# EAGLE design BreakoutDiagram (EAGLE 9.5.2)
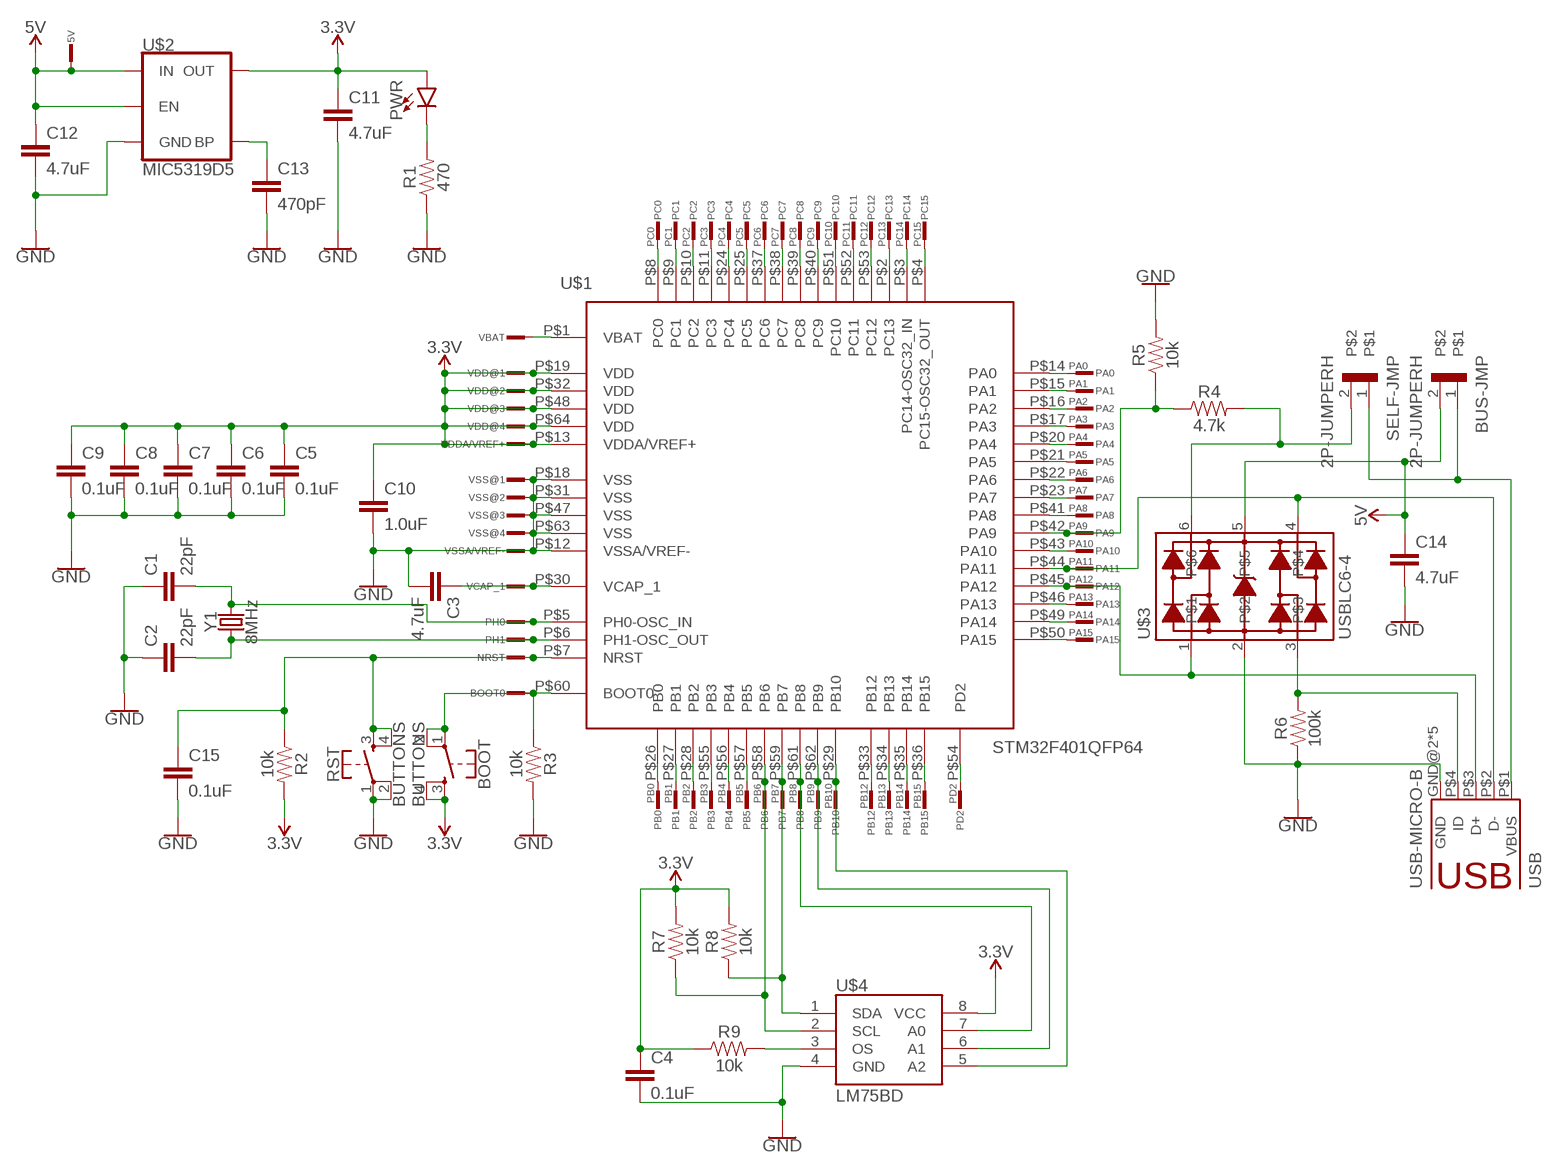
[diagram p0: schematic, sheet 1]

## Parts
5V  PINV  [1X01]
BOOT  BUTTONS  [TACTILE_SWITCH_PTH_6.0MM]
BOOT0  PINH  [1X01_HLABEL]
BUS-JMP  2P-JUMPERH  [1X02]
C1  22pF  22PF-0603-50V-5%  [0603]
C2  22pF  22PF-0603-50V-5%  [0603]
C3  4.7uF  4.7UF-0603-6.3V-(10%)  [0603]
C4  0.1uF  0.1UF-0603-25V-(+80/-20%)  [0603]
C5  0.1uF  0.1UF-0402-16V-10%  [0402]
C6  0.1uF  0.1UF-0402-16V-10%  [0402]
C7  0.1uF  0.1UF-0402-16V-10%  [0402]
C8  0.1uF  0.1UF-0402-16V-10%  [0402]
C9  0.1uF  0.1UF-0402-16V-10%  [0402]
C10  1.0uF  1.0UF-0603-16V-10%  [0603]
C11  4.7uF  4.7UF-0603-6.3V-(10%)  [0603]
C12  4.7uF  4.7UF-0603-6.3V-(10%)  [0603]
C13  470pF  470PF-0603-50V-5%  [0603]
C14  4.7uF  4.7UF-0603-6.3V-(10%)  [0603]
C15  0.1uF  0.1UF-0603-25V-(+80/-20%)  [0603]
NRST  PINH  [1X01_HLABEL]
PA0  PINH  [1X01_HLABEL]
PA1  PINH  [1X01_HLABEL]
PA2  PINH  [1X01_HLABEL]
PA3  PINH  [1X01_HLABEL]
PA4  PINH  [1X01_HLABEL]
PA5  PINH  [1X01_HLABEL]
PA6  PINH  [1X01_HLABEL]
PA7  PINH  [1X01_HLABEL]
PA8  PINH  [1X01_HLABEL]
PA9  PINH  [1X01_HLABEL]
PA10  PINH  [1X01_HLABEL]
PA11  PINH  [1X01_HLABEL]
PA12  PINH  [1X01_HLABEL]
PA13  PINH  [1X01_HLABEL]
PA14  PINH  [1X01_HLABEL]
PA15  PINH  [1X01_HLABEL]
PB0  PINH  [1X01_HLABEL]
PB1  PINH  [1X01_HLABEL]
PB2  PINH  [1X01_HLABEL]
PB3  PINH  [1X01_HLABEL]
PB4  PINH  [1X01_HLABEL]
PB5  PINH  [1X01_HLABEL]
PB6  PINH  [1X01_HLABEL]
PB7  PINH  [1X01_HLABEL]
PB8  PINH  [1X01_HLABEL]
PB9  PINH  [1X01_HLABEL]
PB10  PINH  [1X01_HLABEL]
PB12  PINH  [1X01_HLABEL]
PB13  PINH  [1X01_HLABEL]
PB14  PINH  [1X01_HLABEL]
PB15  PINH  [1X01_HLABEL]
PC0  PINH  [1X01_HLABEL]
PC1  PINH  [1X01_HLABEL]
PC2  PINH  [1X01_HLABEL]
PC3  PINH  [1X01_HLABEL]
PC4  PINH  [1X01_HLABEL]
PC5  PINH  [1X01_HLABEL]
PC6  PINH  [1X01_HLABEL]
PC7  PINH  [1X01_HLABEL]
PC8  PINH  [1X01_HLABEL]
PC9  PINH  [1X01_HLABEL]
PC10  PINH  [1X01_HLABEL]
PC11  PINH  [1X01_HLABEL]
PC12  PINH  [1X01_HLABEL]
PC13  PINH  [1X01_HLABEL]
PC14  PINH  [1X01_HLABEL]
PC15  PINH  [1X01_HLABEL]
PD2  PINH  [1X01_HLABEL]
PH0  PINH  [1X01_HLABEL]
PH1  PINH  [1X01_HLABEL]
PWR  LED0603  [LED-0603]
R1  470  470OHM-0402-1/16W-5%  [0402]
R2  10k  10KOHM-0402-1/16W-1%  [0402]
R3  10k  10KOHM-0402-1/16W-1%  [0402]
R4  4.7k  4.7KOHM-0603-1/10W-1%  [0603]
R5  10k  10KOHM-0603-1/10W-1%  [0603]
R6  100k  100KOHM-0603-1/10W-1%  [0603]
R7  10k  10KOHM-0402-1/16W-1%  [0402]
R8  10k  10KOHM-0402-1/16W-1%  [0402]
R9  10k  10KOHM-0402-1/16W-1%  [0402]
RST  BUTTONS  [TACTILE_SWITCH_PTH_6.0MM]
SELF-JMP  2P-JUMPERH  [1X02]
U$1  STM32F401QFP64  [LQFP64]
U$2  MIC5319D5  [SOT23-5]
U$3  USBLC6-4  [SOT23-6L]
U$4  LM75BD  [SO8]
USB  USB-MICRO-B  [USB-MICRO-B_SMD_CUT]
VBAT  PINH  [1X01_HLABEL]
VCAP_1  PINH  [1X01_HLABEL]
VDD@1  PINH  [1X01_HLABEL]
VDD@2  PINH  [1X01_HLABEL]
VDD@3  PINH  [1X01_HLABEL]
VDD@4  PINH  [1X01_HLABEL]
VDDA/VREF+  PINH  [1X01_HLABEL]
VSS@1  PINH  [1X01_HLABEL]
VSS@2  PINH  [1X01_HLABEL]
VSS@3  PINH  [1X01_HLABEL]
VSS@4  PINH  [1X01_HLABEL]
VSSA/VREF-  PINH  [1X01_HLABEL]
Y1  8MHz  CRYSTALSMD-5X3.2-2PAD  [CRYSTAL-SMD-5X3.2-2PAD]

## Nets
3.3V: BOOT.3 BOOT.4 C4.1 C5.1 C6.1 C7.1 C8.1 C9.1 C10.1 C11.1 PWR.A R2.2 R7.2 R8.2 R9.1 U$1.P$13(VDDA/VREF+) U$1.P$19(VDD) U$1.P$32(VDD) U$1.P$48(VDD) U$1.P$64(VDD) U$2.5(OUT) U$4.8(VCC) VDD@1.1 VDD@2.1 VDD@3.1 VDD@4.1 VDDA/VREF+.1
5V: 5V.1 BUS-JMP.2 C12.1 C14.1 U$2.1(IN) U$2.3(EN) U$3.5
GND: C1.1 C2.1 C3.2 C4.2 C5.2 C6.2 C7.2 C8.2 C9.2 C10.2 C11.2 C12.2 C13.2 C14.2 C15.2 R1.1 R3.2 R5.2 R6.1 RST.1 RST.2 U$1.P$12(VSSA/VREF-) U$1.P$18(VSS) U$1.P$31(VSS) U$1.P$47(VSS) U$1.P$63(VSS) U$2.2(GND) U$3.2 U$4.4(GND) USB.GND@2(GND) USB.GND@3(GND) USB.GND@4(GND) USB.GND@5(GND) USB.P$5(GND) VSS@1.1 VSS@2.1 VSS@3.1 VSS@4.1 VSSA/VREF-.1
N$1: C2.2 PH1.1 U$1.P$6(PH1-OSC_OUT) Y1.P$1
N$2: C1.2 PH0.1 U$1.P$5(PH0-OSC_IN) Y1.P$2
N$3: C3.1 U$1.P$30(VCAP_1) VCAP_1.1
N$4: PWR.C R1.2
N$5: C13.1 U$2.4(BP)
N$6: C15.1 NRST.1 R2.1 RST.3 RST.4 U$1.P$7(NRST)
N$7: BOOT0.1 BOOT.1 BOOT.2 R3.1 U$1.P$60(BOOT0)
N$8: R9.2 U$4.3(OS)
N$9: BUS-JMP.1 SELF-JMP.1 USB.P$1(VBUS)
N$11: R4.2 SELF-JMP.2 U$3.6
N$13: R6.2 U$3.3 USB.P$4(ID)
N$14: U$1.P$1(VBAT) VBAT.1
PA0: PA0.1 U$1.P$14(PA0)
PA1: PA1.1 U$1.P$15(PA1)
PA2: PA2.1 U$1.P$16(PA2)
PA3: PA3.1 U$1.P$17(PA3)
PA4: PA4.1 U$1.P$20(PA4)
PA5: PA5.1 U$1.P$21(PA5)
PA6: PA6.1 U$1.P$22(PA6)
PA7: PA7.1 U$1.P$23(PA7)
PA8: PA8.1 U$1.P$41(PA8)
PA9: PA9.1 R4.1 R5.1 U$1.P$42(PA9)
PA10: PA10.1 U$1.P$43(PA10)
PA11: PA11.1 U$1.P$44(PA11) U$3.4 USB.P$2(D-)
PA12: PA12.1 U$1.P$45(PA12) U$3.1 USB.P$3(D+)
PA13: PA13.1 U$1.P$46(PA13)
PA14: PA14.1 U$1.P$49(PA14)
PA15: PA15.1 U$1.P$50(PA15)
PB0: PB0.1 U$1.P$26(PB0)
PB1: PB1.1 U$1.P$27(PB1)
PB2: PB2.1 U$1.P$28(PB2)
PB3: PB3.1 U$1.P$55(PB3)
PB4: PB4.1 U$1.P$56(PB4)
PB5: PB5.1 U$1.P$57(PB5)
PB6: PB6.1 R7.1 U$1.P$58(PB6) U$4.2(SCL)
PB7: PB7.1 R8.1 U$1.P$59(PB7) U$4.1(SDA)
PB8: PB8.1 U$1.P$61(PB8) U$4.7(A0)
PB9: PB9.1 U$1.P$62(PB9) U$4.6(A1)
PB10: PB10.1 U$1.P$29(PB10) U$4.5(A2)
PB12: PB12.1 U$1.P$33(PB12)
PB13: PB13.1 U$1.P$34(PB13)
PB14: PB14.1 U$1.P$35(PB14)
PB15: PB15.1 U$1.P$36(PB15)
PC0: PC0.1 U$1.P$8(PC0)
PC1: PC1.1 U$1.P$9(PC1)
PC2: PC2.1 U$1.P$10(PC2)
PC3: PC3.1 U$1.P$11(PC3)
PC4: PC4.1 U$1.P$24(PC4)
PC5: PC5.1 U$1.P$25(PC5)
PC6: PC6.1 U$1.P$37(PC6)
PC7: PC7.1 U$1.P$38(PC7)
PC8: PC8.1 U$1.P$39(PC8)
PC9: PC9.1 U$1.P$40(PC9)
PC10: PC10.1 U$1.P$51(PC10)
PC11: PC11.1 U$1.P$52(PC11)
PC12: PC12.1 U$1.P$53(PC12)
PC13: PC13.1 U$1.P$2(PC13)
PC14: PC14.1 U$1.P$3(PC14-OSC32_IN)
PC15: PC15.1 U$1.P$4(PC15-OSC32_OUT)
PD2: PD2.1 U$1.P$54(PD2)

## Library data of the parts
5V BOOT0 NRST PA0 PA1-PA15 PB0 PB1-PB10 PB12-PB15 PC0 PC1-PC15 PD2 PH0 PH1 VBAT VCAP_1 VDD@1-VDD@4 VDDA/VREF+ VSS@1-VSS@4 VSSA/VREF- = myLib:PIN
BOOT RST = myLib:BUTTON
BUS-JMP SELF-JMP = myLib:2P-JUMPER
C1 C2 = SparkFun-Capacitors:22PF: 22pF ceramic capacitors A capacitor is a passive two-terminal electrical component used to store electrical energy temporarily in an electric field.; PROD_ID: CAP-07876
C3 C11 C12 C14 = SparkFun-Capacitors:4.7UF: 4.7µF ceramic capacitors A capacitor is a passive two-terminal electrical component used to store electrical energy temporarily in an electric field.; PROD_ID: CAP-08280
C4 C15 = SparkFun-Capacitors:0.1UF: 0.1µF ceramic capacitors A capacitor is a passive two-terminal electrical component used to store electrical energy temporarily in an electric field.; PROD_ID: CAP-00810
C5-C9 = SparkFun-Capacitors:0.1UF: 0.1µF ceramic capacitors A capacitor is a passive two-terminal electrical component used to store electrical energy temporarily in an electric field.; PROD_ID: CAP-12416
C10 = SparkFun-Capacitors:1.0UF: 1µF ceramic capacitors A capacitor is a passive two-terminal electrical component used to store electrical energy temporarily in an electric field.; PROD_ID: CAP-00868
C13 = SparkFun-Capacitors:470PF: 470pF ceramic capacitors A capacitor is a passive two-terminal electrical component used to store electrical energy temporarily in an electric field.; PROD_ID: CAP-07884
PWR = SparkFun-LED:LED: LED (Generic) Standard schematic elements and footprints for 5mm, 3mm, 1206, and 0603 sized LEDs. Generic LEDs with no color specified.
R1 = SparkFun-Resistors:470OHM: 470Ω resistor A resistor is a passive two-terminal electrical component that implements electrical resistance as a circuit element. Resistors act to reduce current flow, and, at the same time, act to lower voltage levels within circuits. - Wikipedia; PROD_ID: RES-13829
R2 R3 R7-R9 = SparkFun-Resistors:10KOHM: 10kΩ resistor A resistor is a passive two-terminal electrical component that implements electrical resistance as a circuit element. Resistors act to reduce current flow, and, at the same time, act to lower voltage levels within circuits. - Wikipedia; PROD_ID: RES-14241
R4 = SparkFun-Resistors:4.7KOHM: 4.7kΩ resistor A resistor is a passive two-terminal electrical component that implements electrical resistance as a circuit element. Resistors act to reduce current flow, and, at the same time, act to lower voltage levels within circuits. - Wikipedia; PROD_ID: RES-07857
R5 = SparkFun-Resistors:10KOHM: 10kΩ resistor A resistor is a passive two-terminal electrical component that implements electrical resistance as a circuit element. Resistors act to reduce current flow, and, at the same time, act to lower voltage levels within circuits. - Wikipedia; PROD_ID: RES-00824
R6 = SparkFun-Resistors:100KOHM: 100kΩ resistor A resistor is a passive two-terminal electrical component that implements electrical resistance as a circuit element. Resistors act to reduce current flow, and, at the same time, act to lower voltage levels within circuits. - Wikipedia; PROD_ID: RES-07828
U$1 = myLib:STM32F401
U$2 = myLib:MIC5319
U$3 = myLib:USBLC6-4: USBLC6-4 USB Circuit Protection Used for STM32 USB self-powered configuration Product Link: https://www.digikey.com/product-detail/en/stmicroelectronics/USBLC6-4SC6/497-4492-1-ND/725667
U$4 = myLib:LM75B: LM75B Digital Temperature Sensor and Thermal Watchdog Datasheet <https://www.nxp.com/docs/en/data-sheet/LM75B.pdf> Digikey Links: SO8 Package <https://www.digikey.com/product-detail/en/nxp-usa-inc/LM75BD-118/568-4688-1-ND/1993025>
USB = myLib:USB-MICRO-B
Y1 = SparkFun-Clocks:CRYSTAL: Crystals (Generic) These are passive quartz crystals, which can be used as a clock source for a microcontroller. Crystal's are two-terminal devices. They require external "load" capacitors to generate an oscillating signal.

## Board
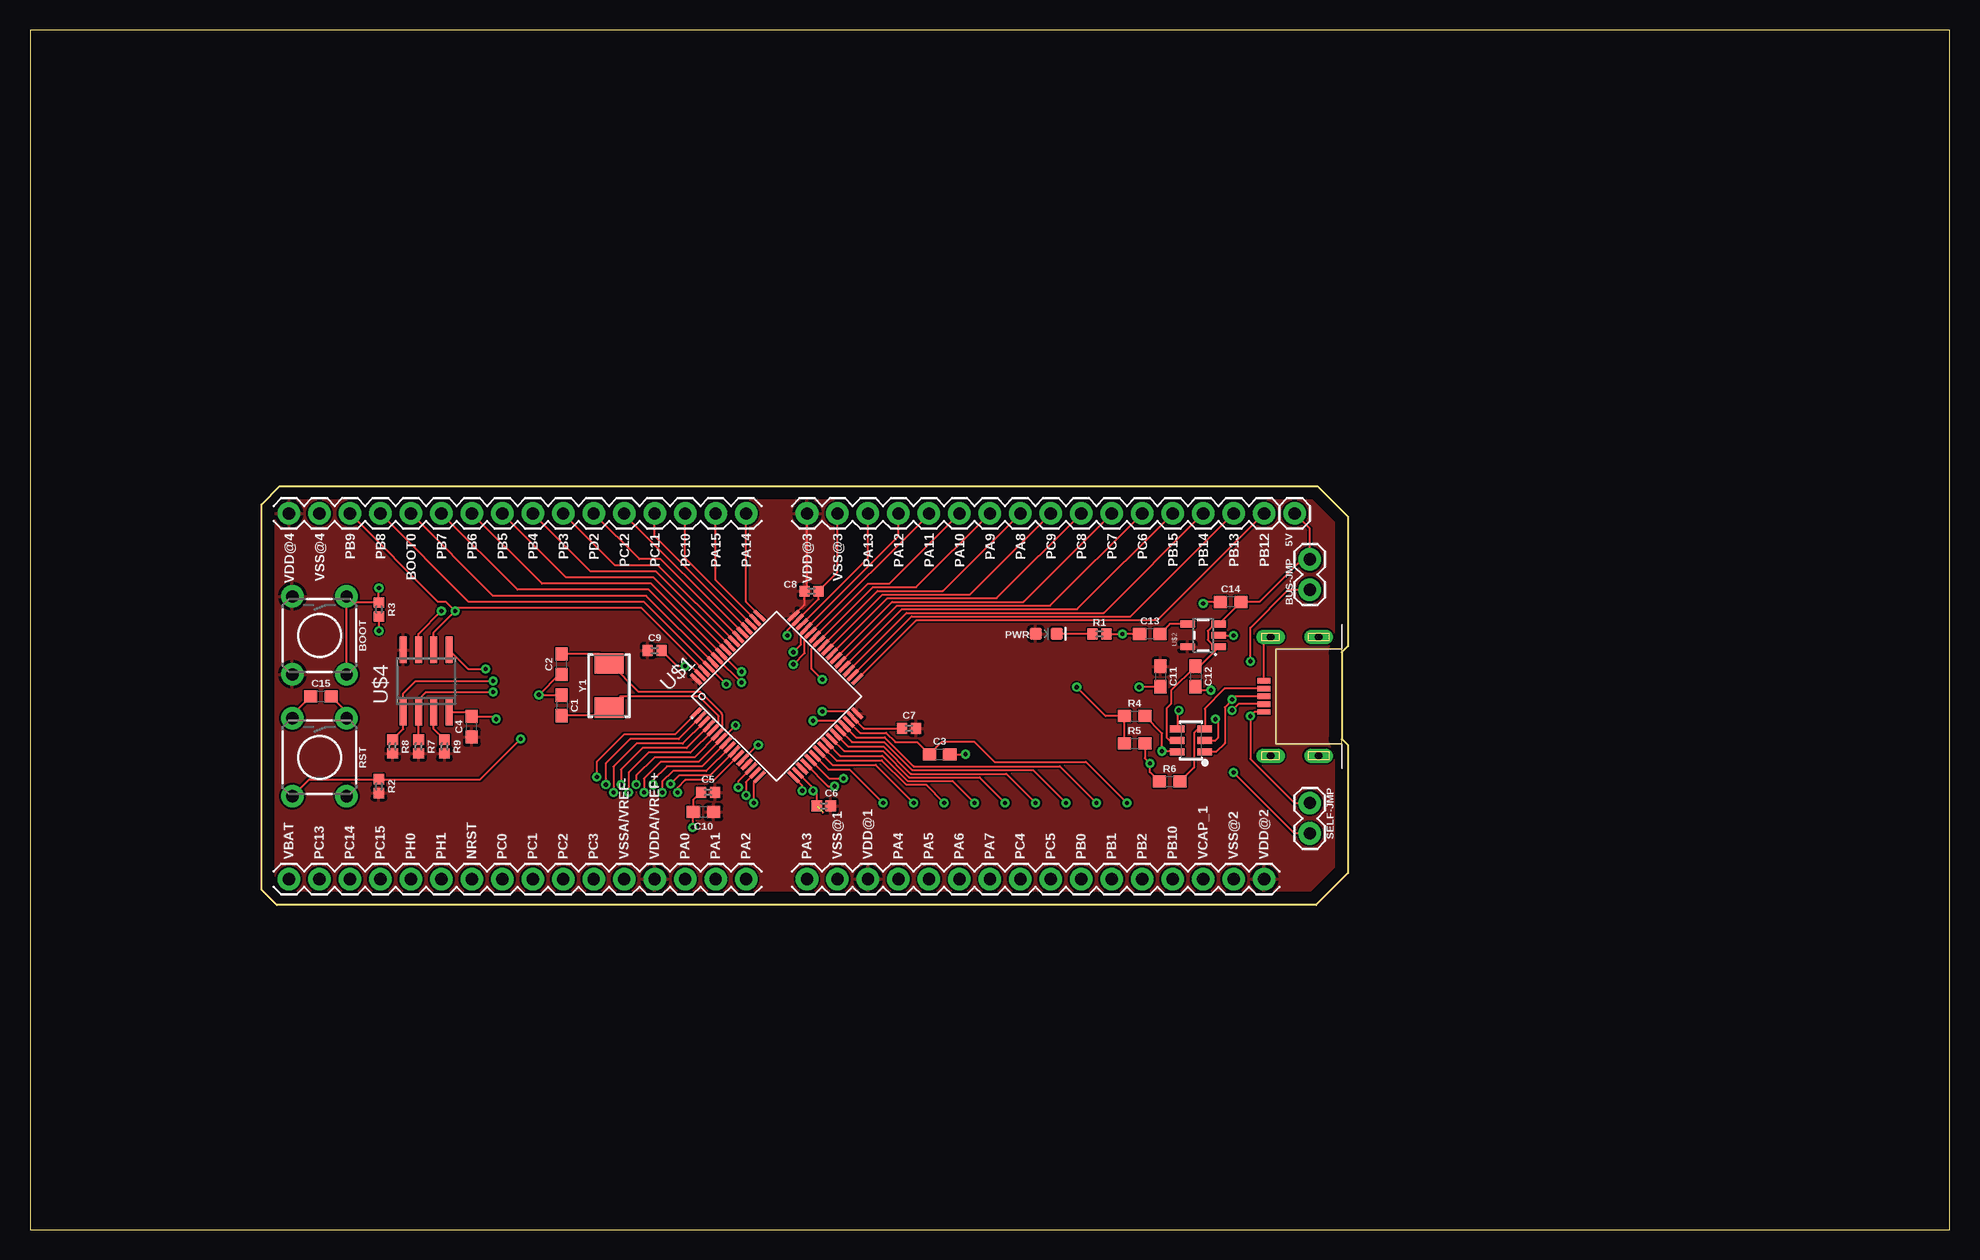
[diagram p1: board, top side]
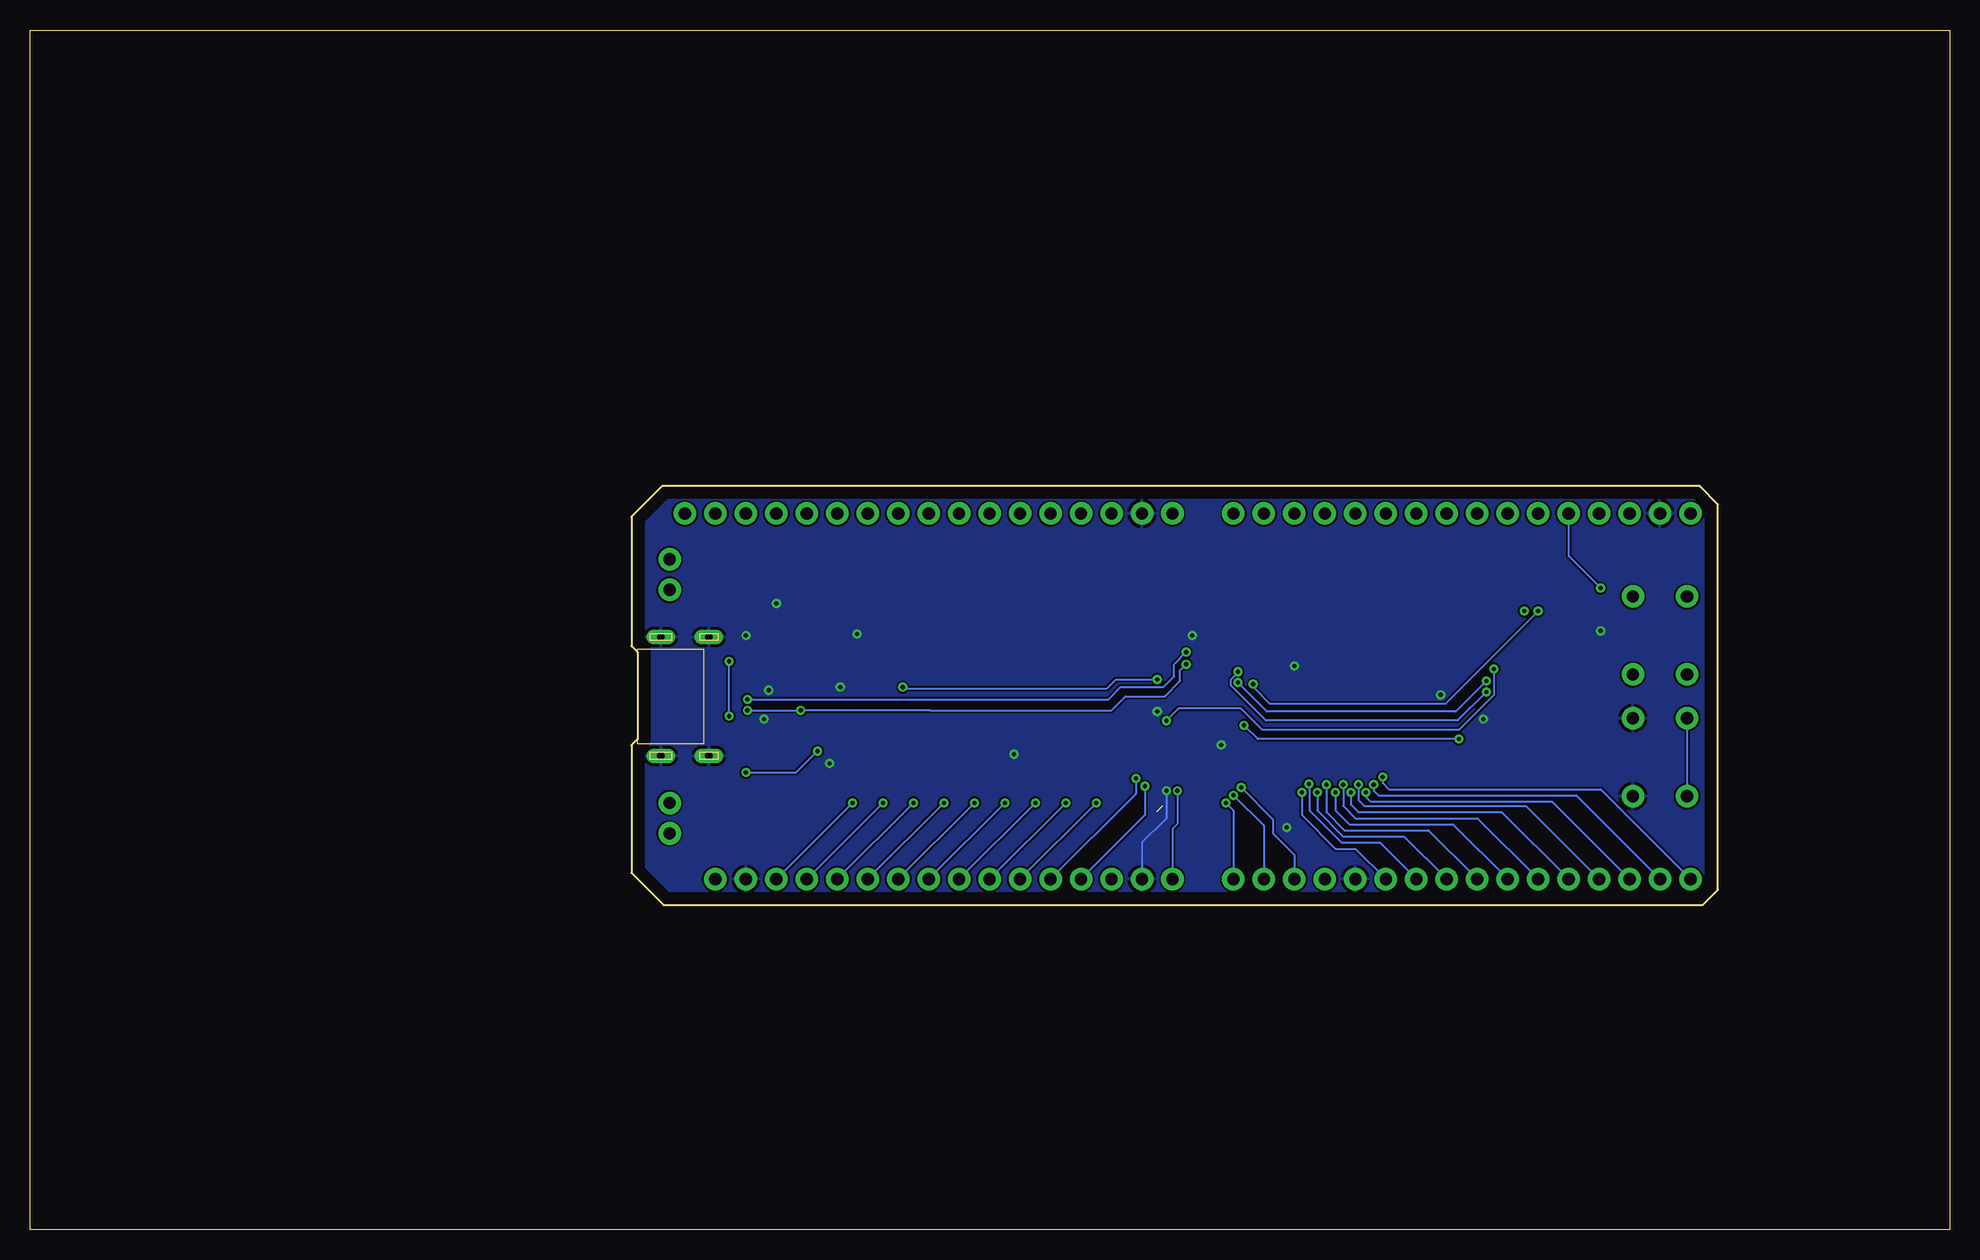
[diagram p2: board, bottom side, seen from below]

Size 160 x 100 mm. Coordinates in mm from the lower left corner, seen from the top.
Outline: 0,0 160,0 160,100 0,100 0,0
Outline: 109.86,29.72 107.19,27.05 20.57,27.05 19.3,28.32 19.3,60.45 20.83,61.98 107.31,61.98 109.86,59.44 109.86,48.64 109.35,48.13 109.35,40.89 109.86,40.39 109.86,29.72
Copper layers (1*16): Top 0.035mm / dielectric 1.5mm / Bottom 0.035mm
Design rules "default": minimum track width 6mil, minimum drill 0.35mm, track to track 6mil, track to pad 6mil, pad to pad 6mil, via to via 6mil, smd to smd 6mil, copper to edge 40mil, drill to drill 6mil, minimum pad ring 10mil, minimum via ring 8mil, stop-mask expansion 4mil, vias tented up to drill 0mil, thermal gap 10mil

### Footprints (pad centres in the part's own frame; a part is rotated, then mirrored left to right if it is on the bottom)
1X01 = drill 1.016 pad 1.88: 1 0,0
TACTILE_SWITCH_PTH_6.0MM = drill 1.016 pad 1.88: 1 -3.251,2.261; 2 3.251,2.261; 3 -3.251,-2.261; 4 3.251,-2.261
1X01_HLABEL = drill 1.016 pad 1.88: 1 0,0
1X02 = drill 1.016 pad 1.88: 1 0,0; 2 2.54,0
0603 = smd 1.1 x 1: 1 -0.85,0; 2 0.85,0
0402 = smd 0.85 x 0.9: 1 -0.58,0; 2 0.58,0
LED-0603 = smd 1 x 1: A -0.877,0; C 0.877,0
LQFP64 = smd 1.2 x 0.3: P$1 -5.75,3.75; P$2 -5.75,3.25; P$3 -5.75,2.75; P$4 -5.75,2.25; P$5 -5.75,1.75; P$6 -5.75,1.25; P$7 -5.75,0.75; P$8 -5.75,0.25; P$9 -5.75,-0.25; P$10 -5.75,-0.75; P$11 -5.75,-1.25; P$12 -5.75,-1.75; P$13 -5.75,-2.25; P$14 -5.75,-2.75; P$15 -5.75,-3.25; P$16 -5.75,-3.75; P$33 5.75,-3.75; P$34 5.75,-3.25; P$35 5.75,-2.75; P$36 5.75,-2.25; P$37 5.75,-1.75; P$38 5.75,-1.25; P$39 5.75,-0.75; P$40 5.75,-0.25; P$41 5.75,0.25; P$42 5.75,0.75; P$43 5.75,1.25; P$44 5.75,1.75; P$45 5.75,2.25; P$46 5.75,2.75; P$47 5.75,3.25; P$48 5.75,3.75 | smd 0.3 x 1.2: P$17 -3.75,-5.75; P$18 -3.25,-5.75; P$19 -2.75,-5.75; P$20 -2.25,-5.75; P$21 -1.75,-5.75; P$22 -1.25,-5.75; P$23 -0.75,-5.75; P$24 -0.25,-5.75; P$25 0.25,-5.75; P$26 0.75,-5.75; P$27 1.25,-5.75; P$28 1.75,-5.75; P$29 2.25,-5.75; P$30 2.75,-5.75; P$31 3.25,-5.75; P$32 3.75,-5.75; P$49 3.75,5.75; P$50 3.25,5.75; P$51 2.75,5.75; P$52 2.25,5.75; P$53 1.75,5.75; P$54 1.25,5.75; P$55 0.75,5.75; P$56 0.25,5.75; P$57 -0.25,5.75; P$58 -0.75,5.75; P$59 -1.25,5.75; P$60 -1.75,5.75; P$61 -2.25,5.75; P$62 -2.75,5.75; P$63 -3.25,5.75; P$64 -3.75,5.75
SOT23-5 = smd 0.55 x 1.2: 1 -0.95,-1.3; 2 0,-1.3; 3 0.95,-1.3; 4 0.95,1.3; 5 -0.95,1.3
SOT23-6L = smd 0.6 x 1.2: 1 -0.95,-1.15; 2 0,-1.15; 3 0.95,-1.15; 4 0.95,1.15; 5 0,1.15; 6 -0.95,1.15
SO8 = smd 0.6 x 2.2: 1 -1.905,-2.6; 2 -0.635,-2.6; 3 0.635,-2.6; 4 1.905,-2.6; 5 1.905,2.6; 6 0.635,2.6; 7 -0.635,2.6; 8 -1.905,2.6
USB-MICRO-B_SMD_CUT = drill 0.6 pad 1.2 long: GND@2 -4.95,2; GND@3 4.95,2; GND@4 4.95,-2; GND@5 -4.95,-2 | smd 0.45 x 1.1: P$1 -1.3,2.55; P$2 -0.65,2.55; P$3 0,2.55; P$4 0.65,2.55; P$5 1.3,2.55
CRYSTAL-SMD-5X3.2-2PAD = smd 1.7 x 2.4: P$1 1.85,0; P$2 -1.85,0

### Placement (x,y rotation side)
5V  105.41,59.69 0 top
BOOT  24.13,49.53 270 top
BOOT0  31.75,59.69 0 top
BUS-JMP  106.68,53.34 90 top
C1  44.32,43.69 270 top
C2  44.32,47.12 90 top
C3  75.82,39.62 0 top
C4  36.83,41.91 90 top
C5  56.52,36.45 180 top
C6  66.17,35.31 180 top
C7  73.28,41.78 180 top
C8  65.15,53.21 0 top
C9  52.07,48.26 0 top
C10  56.13,34.8 180 top
C11  94.23,46.1 270 top
C12  97.16,46.1 270 top
C13  93.34,49.66 180 top
C14  100.08,52.32 180 top
C15  24.26,44.45 0 top
NRST  36.83,29.21 180 top
PA0  54.61,29.21 180 top
PA1  57.15,29.21 180 top
PA2  59.69,29.21 180 top
PA3  64.77,29.21 180 top
PA4  72.39,29.21 180 top
PA5  74.93,29.21 180 top
PA6  77.47,29.21 180 top
PA7  80.01,29.21 180 top
PA8  82.55,59.69 0 top
PA9  80.01,59.69 0 top
PA10  77.47,59.69 0 top
PA11  74.93,59.69 0 top
PA12  72.39,59.69 0 top
PA13  69.85,59.69 0 top
PA14  59.69,59.69 0 top
PA15  57.15,59.69 0 top
PB0  87.63,29.21 180 top
PB1  90.17,29.21 180 top
PB2  92.71,29.21 180 top
PB3  44.45,59.69 0 top
PB4  41.91,59.69 0 top
PB5  39.37,59.69 0 top
PB6  36.83,59.69 0 top
PB7  34.29,59.69 0 top
PB8  29.21,59.69 0 top
PB9  26.67,59.69 0 top
PB10  95.25,29.21 180 top
PB12  102.87,59.69 0 top
PB13  100.33,59.69 0 top
PB14  97.79,59.69 0 top
PB15  95.25,59.69 0 top
PC0  39.37,29.21 180 top
PC1  41.91,29.21 180 top
PC2  44.45,29.21 180 top
PC3  46.99,29.21 180 top
PC4  82.55,29.21 180 top
PC5  85.09,29.21 180 top
PC6  92.71,59.69 0 top
PC7  90.17,59.69 0 top
PC8  87.63,59.69 0 top
PC9  85.09,59.69 0 top
PC10  54.61,59.69 0 top
PC11  52.07,59.69 0 top
PC12  49.53,59.69 0 top
PC13  24.13,29.21 180 top
PC14  26.67,29.21 180 top
PC15  29.21,29.21 180 top
PD2  46.99,59.69 0 top
PH0  31.75,29.21 180 top
PH1  34.29,29.21 180 top
PWR  84.71,49.66 0 top
R1  89.15,49.66 180 top
R2  29.08,36.96 270 top
R3  29.08,51.69 270 top
R4  92.08,42.8 0 top
R5  92.08,40.51 0 top
R6  95,37.34 0 top
R7  32.38,40.26 270 top
R8  30.23,40.26 270 top
R9  34.54,40.26 90 top
RST  24.13,39.37 270 top
SELF-JMP  106.68,35.56 270 top
U$1  62.23,44.45 45 top
U$2  97.79,49.53 90 top
U$3  96.77,40.77 90 top
U$4  33.02,45.72 0 top
USB  105.41,44.45 90 top
VBAT  21.59,29.21 180 top
VCAP_1  97.79,29.21 180 top
VDD@1  69.85,29.21 180 top
VDD@2  102.87,29.21 180 top
VDD@3  64.77,59.69 0 top
VDD@4  21.59,59.69 0 top
VDDA/VREF+  52.07,29.21 180 top
VSS@1  67.31,29.21 180 top
VSS@2  100.33,29.21 180 top
VSS@3  67.31,59.69 0 top
VSS@4  24.13,59.69 0 top
VSSA/VREF-  49.53,29.21 180 top
Y1  48.26,45.34 90 top

### Tracks (layer width: path | path; a pad name or v marks a point on that pad's centre or on a via)
3.3V
  Top 0.152: U$1.P$48 64.57,52.09 C8.1 64.77,53.41 VDD@3.1
  pour Top: 20.32,63.5 17.78,60.96 17.78,27.94 20.32,25.4 107.95,25.4 110.49,27.94 110.49,60.96 107.95,63.5
5V
  Top 0.152: U$3.5 95,40.77 94.74,41.02 94.74,43.43 95.12,43.81 95.12,44.92 C12.1 97.46,46.95 U$2.1 98.74,48.58 98.17,49.15 98.17,49.91 98.74,50.48 U$2.3 C14.1 102.49,52.32 106.05,55.88 BUS-JMP.2 106.68,58.42 5V.1
GND  (via drill 0.35)  (1 unrouted)
  Top 0.152: C14.2 97.92,52.32 v97.79,52.2 | 98.68,49.53 U$2.2 v100.33,49.53 | 97.19,45.25 C12.2 97.45,44.96 v98.42,44.96 | C11.2 94.19,45.21 v92.46,45.21 | C13.2 v91.06,49.66 R1.1 | USB.P$5 102.86,48.85 USB.GND@3 | U$3.2 98.81,40.77 99.06,41.02 99.06,42.29 v98.81,42.55 | R6.1 93.34,38.14 v93.34,38.86 92.92,39.28 R5.2 | C7.2 69.49,41.78 U$1.P$31 68.1,43.18 v66.04,43.18 | U$1.P$18 65.28,36.81 v65.28,36.58 65.59,36.27 C6.2 | 66.09,34.8 66.09,34.76 | VSS@3.1 67.31,54.79 C8.2 65.73,52.55 U$1.P$47 63.12,49.94 v63.12,49.53 | C3.2 v77.98,39.62 | U$1.P$12 60.64,40.39 v60.71,40.39 | C2.1 44.11,46.27 v42.42,44.58 42.46,44.54 C1.1 | U$4.4 36.47,43.12 C4.2 38.65,42.76 v38.86,42.55 | C5.2 55.28,35.8 C10.2 55.24,34.76 v55.24,33.53 | R3.2 v29.08,49.91 | U$1.P$63 55.09,46.99 v54.61,46.99 53.92,46.99 C9.2 | C15.2 26.39,43.17 RST.1
  Bottom 0.152: v65.28,36.58 65.28,34.29 67.31,32.26 VSS@1.1
  pour Bottom: 17.78,60.96 17.78,27.94 20.32,25.4 107.95,25.4 110.49,27.94 110.49,60.96 107.95,63.5 20.32,63.5
N$1  (via drill 0.35)
  Top 0.152: C2.2 47.48,47.97 Y1.P$1 48.39,47.19 | 48.39,47.19 48.82,47.19 | 48.39,47.19 50.74,44.83 55.88,44.83 57.66,43.05 57.66,42.98 57.71,42.92 57.71,41.7 U$1.P$6 55.38,39.37 52.07,39.37 50.54,37.84 v50.54,37.09
  Bottom 0.152: PH1.1 39.37,34.29 49.53,34.29 50.54,35.3 v50.54,37.09
N$2  (via drill 0.35)
  Top 0.152: C1.2 47.61,42.84 Y1.P$2 49.22,44.45 55.75,44.45 57.4,42.8 57.4,42.1 U$1.P$5 55.06,39.75 51.56,39.75 49.9,38.09 v49.9,36.44
  Bottom 0.152: v49.9,36.44 49.9,35.42 49.28,34.8 37.34,34.8 PH0.1
N$3  (via drill 0.35)
  Top 0.152: U$1.P$30 69.17,41.4 71.37,41.4 72.14,40.64 73.95,40.64 C3.1 75.98,40.64 78.74,40.64 80.39,38.99 88.01,38.99 v91.44,35.56
  Bottom 0.152: v91.44,35.56 VCAP_1.1
N$4
  Top 0.152: R1.2 PWR.C
N$5
  Top 0.152: U$2.4 95.02,50.48 C13.1
N$6  (via drill 0.35)
  Top 0.152: RST.4 23.29,37.54 R2.1 37.54,37.54 v40.89,40.89 | v58.8,42.04 57.68,40.91 U$1.P$7 55.71,38.99 52.58,38.99 51.18,37.59 v51.18,36.45 | RST.3 21.87,42.91 C15.1
  Bottom 0.152: v40.89,40.89 57.66,40.89 v58.8,42.04 | NRST.1 41.4,33.78 50.04,33.78 51.18,34.92 v51.18,36.45 | RST.4 RST.3
N$7  (via drill 0.35)
  Top 0.152: BOOT.2 BOOT.1 26.9,52.27 R3.1 v29.08,53.47 | U$1.P$60 51.37,52.83 38.61,52.83 BOOT0.1
  Bottom 0.152: v29.08,53.47 31.75,56.13 BOOT0.1
N$8
  Top 0.152: R9.2 33.66,41.73 U$4.3
N$9  (via drill 0.35)
  Top 0.152: USB.P$1 102.08,43.15 v101.73,42.8 101.73,39.24 105.41,35.56 SELF-JMP.1 | v101.73,47.37 101.73,50.16 104.9,53.34 BUS-JMP.1
  Bottom 0.152: 101.73,43.05 v101.73,42.8 v101.73,47.37
N$11  (via drill 0.35)
  Top 0.152: SELF-JMP.2 105.41,33.02 v100.33,38.1 | U$3.6 95.56,39.88 v94.36,39.88 94.36,41.36 R4.2
  Bottom 0.152: v100.33,38.1 96.14,38.1 v94.36,39.88
N$13
  Top 0.152: 98.34,41.72 U$3.3 | U$3.3 97.34,41.72 97.03,41.4 97.03,38.52 R6.2 | USB.P$4 99.58,45.1 97.92,43.43 U$3.3
N$14  (via drill 0.35)
  Top 0.152: U$1.P$1 53.75,41.27 49.53,41.27 47.24,38.99 v47.24,37.72
  Bottom 0.152: v47.24,37.72 47.24,37.21 46.74,36.7 29.08,36.7 VBAT.1
PA0  (via drill 0.35)
  Top 0.152: U$1.P$14 59.04,37.37 v59.04,36.84
  Bottom 0.152: v59.04,36.84 56.39,34.19 56.39,33.02 54.61,31.24 PA0.1
PA1  (via drill 0.35)
  Top 0.152: U$1.P$15 59.68,37.31 v59.68,36.2
  Bottom 0.152: v59.68,36.2 57.15,33.67 PA1.1
PA2  (via drill 0.35)
  Top 0.152: U$1.P$16 60.33,37.24 v60.33,35.56
  Bottom 0.152: v60.33,35.56 59.69,34.92 PA2.1
PA3  (via drill 0.35)
  Top 0.152: 64.64,29.34 PA3.1 | U$1.P$17 64.37,37.01 v64.37,36.58
  Bottom 0.152: v64.37,36.58 64.37,33.8 64.77,33.4 PA3.1
PA4  (via drill 0.35)
  Top 0.152: U$1.P$20 66.54,36.96 v67.06,36.96
  Bottom 0.152: v67.06,36.96 67.06,34.54 PA4.1
PA5  (via drill 0.35)
  Top 0.152: 74.93,29.27 PA5.1 | U$1.P$21 66.61,37.59 v67.82,37.59
  Bottom 0.152: v67.82,37.59 67.82,36.32 PA5.1
PA6  (via drill 0.35)
  Top 0.152: U$1.P$22 66.56,38.35 68.33,38.35 v71.12,35.56
  Bottom 0.152: v71.12,35.56 PA6.1
PA7  (via drill 0.35)
  Top 0.152: U$1.P$23 66.88,38.73 70.48,38.73 v73.66,35.56
  Bottom 0.152: v73.66,35.56 PA7.1
PA8
  Top 0.152: U$1.P$41 70.67,53.24 76.1,53.24 PA8.1
PA9  (via drill 0.35)
  Top 0.152: R5.1 R4.1 89.66,42.8 v87.25,45.21 | PA9.1 73.86,53.54 70.26,53.54 U$1.P$42 65.15,48.43 65.15,46.74 v66.04,45.85
  Bottom 0.152: v87.25,45.21 87.12,45.09 70.23,45.09 69.47,45.85 v66.04,45.85
PA10
  Top 0.152: U$1.P$43 69.86,53.85 71.63,53.85 PA10.1
PA11  (via drill 0.35)
  Top 0.152: U$3.4 95.63,43.16 v95.76,43.29 | USB.P$2 100.72,43.8 v100.2,43.29 | U$1.P$44 74.93,59.62 PA11.1 | 64.99,49.75 U$1.P$44 | v63.63,47.12 64.57,48.06 64.57,49.28 65.04,49.75 U$1.P$44
  Bottom 0.152: v100.2,43.29 v95.76,43.29 84.98,43.29 | 84.96,43.31 84.98,43.29 | 84.98,43.29 69.85,43.29 68.69,44.45 65.41,44.45 64.14,45.72 64.14,46.61 v63.63,47.12
PA12  (via drill 0.35)
  Top 0.152: USB.P$3 100.46,44.45 v100.2,44.2 100.2,44.15 99.6,43.54 99.6,40.54 98.87,39.82 U$3.1 | PA12.1 72.39,57.79 64.77,50.17 U$1.P$45 64.26,49.66 64.26,48.77 v63.63,48.13
  Bottom 0.152: v100.2,44.2 70.1,44.2 69.09,45.21 65.53,45.21 64.64,46.1 64.64,47.12 v63.63,48.13
PA13
  Top 0.152: U$1.P$46 69.85,55.96 PA13.1
PA14
  Top 0.152: U$1.P$49 59.69,52.29 PA14.1
PA15
  Top 0.152: U$1.P$50 57.15,54.13 PA15.1
PB0  (via drill 0.35)
  Top 0.152: U$1.P$26 67.86,39.88 71.1,39.88 73.28,37.69 79.15,37.69 v81.28,35.56
  Bottom 0.152: v81.28,35.56 PB0.1
PB1  (via drill 0.35)
  Top 0.152: U$1.P$27 68.19,40.26 71.15,40.26 73.41,38 81.38,38 v83.82,35.56
  Bottom 0.152: v83.82,35.56 PB1.1
PB2  (via drill 0.35)
  Top 0.152: U$1.P$28 68.52,40.64 71.2,40.64 73.53,38.3 83.62,38.3 v86.36,35.56
  Bottom 0.152: v86.36,35.56 PB2.1
PB3
  Top 0.152: U$1.P$55 52.37,55.37 48.77,55.37 PB3.1
PB4
  Top 0.152: U$1.P$56 52.17,54.86 46.74,54.86 PB4.1
PB5
  Top 0.152: U$1.P$57 51.97,54.36 44.7,54.36 PB5.1
PB6  (via drill 0.35)
  Top 0.152: R7.1 U$4.2 32.38,44.2 33,44.81 v38.61,44.81 | v59.31,46.5 59.12,46.5 U$1.P$58 51.77,53.85 42.67,53.85 PB6.1
  Bottom 0.152: v38.61,44.81 41,42.42 56.99,42.42 59.92,45.34 59.92,45.84 59.31,46.45 v59.31,46.5
PB7  (via drill 0.35)
  Top 0.152: R8.1 31.11,41.73 U$4.1 31.11,44.7 32.13,45.72 v38.61,45.72 | v59.31,45.59 U$1.P$59 51.57,53.34 40.64,53.34 PB7.1
  Bottom 0.152: v38.61,45.72 41.15,43.18 56.9,43.18 v59.31,45.59
PB8  (via drill 0.35)
  Top 0.152: U$4.7 32.38,49.66 v34.29,51.56 | v58.04,45.47 v58.03,45.47 U$1.P$61 51.17,52.32 36.58,52.32 PB8.1
  Bottom 0.152: v34.29,51.56 42.04,43.81 56.64,43.81 58.04,45.21 v58.04,45.47
PB9  (via drill 0.35)
  Top 0.152: U$4.6 33.66,49.78 v35.43,51.56 | U$1.P$62 50.98,51.82 35.69,51.82 v35.43,51.56 | v35.43,51.56 34.67,52.32 34.04,52.32 PB9.1
PB10  (via drill 0.35)
  Top 0.152: U$4.5 36.51,46.74 v37.97,46.74 | v65.28,42.42 67.44,42.42 U$1.P$29 68.84,41.02 71.25,41.02 73.66,38.61 85.85,38.61 v88.9,35.56
  Bottom 0.152: v37.97,46.74 37.97,44.58 40.89,41.66 57.28,41.66 59.05,43.43 64.26,43.43 v65.28,42.42 | v88.9,35.56 PB10.1
PB12
  Top 0.152: U$1.P$33 73.88,50.8 93.98,50.8 PB12.1
PB13
  Top 0.152: U$1.P$34 73.48,51.1 91.75,51.1 PB13.1
PB14
  Top 0.152: U$1.P$35 73.08,51.41 89.51,51.41 PB14.1
PB15
  Top 0.152: U$1.P$36 72.68,51.71 87.27,51.71 PB15.1
PC0  (via drill 0.35)
  Top 0.152: U$1.P$8 56.03,38.61 53.09,38.61 51.94,37.47 v51.94,37.08
  Bottom 0.152: PC0.1 43.43,33.27 50.42,33.27 51.94,34.8 v51.94,37.08
PC1  (via drill 0.35)
  Top 0.152: 41.91,29.34 PC1.1 | U$1.P$9 56.36,38.23 53.59,38.23 52.7,37.34 v52.7,36.45
  Bottom 0.152: PC1.1 45.47,32.77 50.55,32.77 52.7,34.92 v52.7,36.45
PC2  (via drill 0.35)
  Top 0.152: U$1.P$10 56.69,37.85 54.09,37.85 v53.4,37.16
  Bottom 0.152: PC2.1 47.5,32.26 50.67,32.26 53.34,34.92 53.34,37.1 v53.4,37.16
PC3  (via drill 0.35)
  Top 0.152: U$1.P$11 57.01,37.47 54.61,37.47 53.98,36.83 v53.98,36.45
  Bottom 0.152: v53.98,36.45 53.98,34.54 51.18,31.75 49.53,31.75 PC3.1
PC4  (via drill 0.35)
  Top 0.152: U$1.P$24 67.21,39.12 71,39.12 73.03,37.08 74.68,37.08 v76.2,35.56
  Bottom 0.152: PC4.1 v76.2,35.56
PC5  (via drill 0.35)
  Top 0.152: U$1.P$25 67.54,39.5 71.05,39.5 73.16,37.39 76.91,37.39 v78.74,35.56
  Bottom 0.152: v78.74,35.56 PC5.1
PC6
  Top 0.152: U$1.P$37 72.27,52.02 85.04,52.02 PC6.1
PC7
  Top 0.152: U$1.P$38 71.37,51.82 71.87,52.32 82.8,52.32 PC7.1
PC8
  Top 0.152: U$1.P$39 71.47,52.63 80.57,52.63 PC8.1
PC9
  Top 0.152: U$1.P$40 71.07,52.93 78.33,52.93 PC9.1
PC10
  Top 0.152: U$1.P$51 54.61,55.96 PC10.1
PC11
  Top 0.152: U$1.P$52 52.07,57.79 PC11.1
PC12
  Top 0.152: U$1.P$53 49.53,59.62 PC12.1
PC13  (via drill 0.35)
  Top 0.152: U$1.P$2 54.08,40.89 50.04,40.89 48,38.85 v48,37.09
  Bottom 0.152: v48,37.09 48,36.57 47.62,36.2 31.11,36.2 PC13.1
PC14  (via drill 0.35)
  Top 0.152: U$1.P$3 54.4,40.51 50.55,40.51 48.63,38.6 v48.63,36.44
  Bottom 0.152: v48.63,36.44 48.63,36.06 48.26,35.69 33.15,35.69 PC14.1
PC15  (via drill 0.35)
  Top 0.152: 29.21,29.34 PC15.1 | U$1.P$4 54.73,40.13 51.05,40.13 49.27,38.35 v49.27,37.09
  Bottom 0.152: v49.27,37.09 49.27,35.81 48.77,35.31 35.31,35.31 PC15.1
PD2
  Top 0.152: U$1.P$54 52.57,55.88 50.8,55.88 PD2.1